# EAGLE design PassVault (EAGLE 9.6.2)
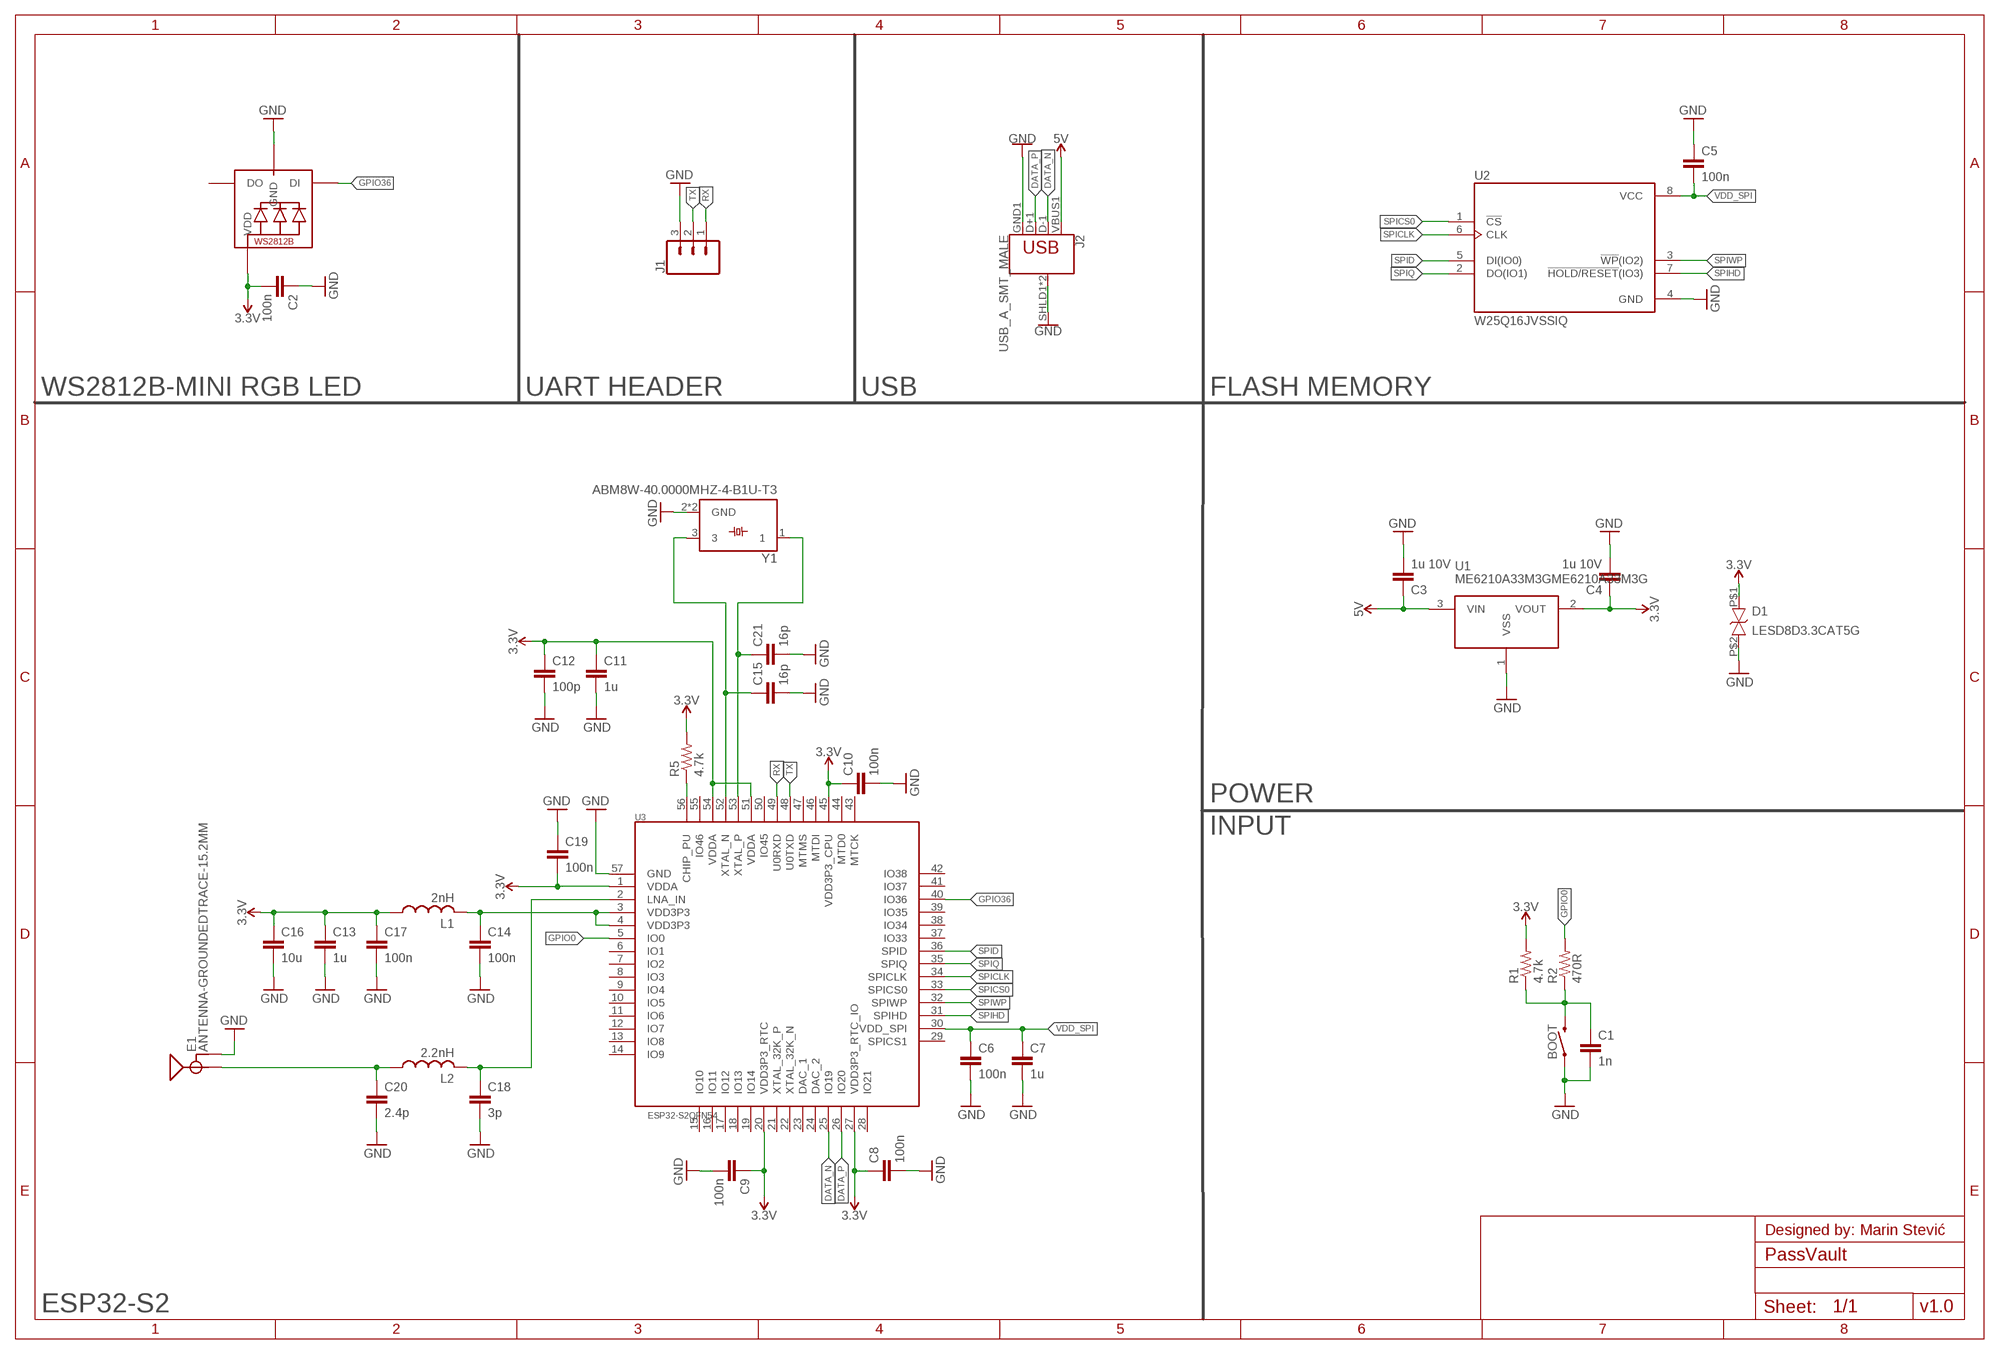
[diagram p0: schematic, sheet 1]

## Parts
BOOT  MOMENTARY-SWITCH-SPST-SMD-12MM  [TACTILE_SWITCH_SMD_12MM]
C1  1n  C-EUC0201  [C0201]
C2  100n  C-EUC0402  [C0402]
C3  1u 10V  C-EUC0402  [C0402]
C4  1u 10V  C-EUC0402  [C0402]
C5  100n  C-EUC0201  [C0201]
C6  100n  C-EUC0201  [C0201]
C7  1u  C-EUC0201  [C0201]
C8  100n  C-EUC0201  [C0201]
C9  100n  C-EUC0201  [C0201]
C10  100n  C-EUC0201  [C0201]
C11  1u  C-EUC0201  [C0201]
C12  100p  C-EUC0201  [C0201]
C13  1u  C-EUC0201  [C0201]
C14  100n  C-EUC0201  [C0201]
C15  16p  C-EUC0201  [C0201]
C16  10u  C-EUC0402  [C0402]
C17  100n  C-EUC0201  [C0201]
C18  3p  C-EUC0201  [C0201]
C19  100n  C-EUC0201  [C0201]
C20  2.4p  C-EUC0201  [C0201]
C21  16p  C-EUC0201  [C0201]
D1  LESD8D3.3CAT5G  [LESD8D3.3CAT5G]
E1  ANTENNA-GROUNDEDTRACE-15.2MM  [TRACE_ANTENNA_2.4GHZ_15.2MM]
J1  CONN_03  [1X03]
J2  USB_A_SMT_MALE  [USB-A-SMT-MALE]
L1  2nH  L-USL0201  [L0201]
L2  2.2nH  L-USL0201  [L0201]
LED1  WS2812B3535  [LED3535]
R1  4.7k  R-US_R0201  [R0201]
R2  470R  R-US_R0201  [R0201]
R5  4.7k  R-US_R0201  [R0201]
U1  ME6210A33M3GME6210A33M3G  [SOT95P280X110-3N]
U2  W25Q16JVSSIQ  [SOIC127P790X216-8N]
U3  ESP32-S2QFN54  [QFN40P700X700X90-57T400N]
Y1  ABM8W-40.0000MHZ-4-B1U-T3  [OSCSC320X250X100N]

## Nets
3.3V: C2.2 C4.1 C8.1 C9.1 C10.1 C11.1 C12.1 C13.1 C16.1 C17.1 C19.2 D1.P$1 L1.1 LED1.1(VDD) R1.2 R5.2 U1.2(VOUT) U3.1(VDDA) U3.20(VDD3P3_RTC) U3.27(VDD3P3_RTC_IO) U3.45(VDD3P3_CPU) U3.51(VDDA) U3.54(VDDA)
3.3V1: C20.1 E1.ANT(SIGNAL) L2.1
5V: C3.1 J2.VBUS1(VBUS) U1.3(VIN)
DATA_N: J2.D-1(D-) U3.25(IO19)
DATA_P: J2.D+1(D+) U3.26(IO20)
GND: BOOT.1 C1.2 C2.1 C3.2 C4.2 C5.1 C6.2 C7.2 C8.2 C9.2 C10.2 C11.2 C12.2 C13.2 C14.2 C15.2 C16.2 C17.2 C18.2 C19.1 C20.2 C21.2 D1.P$2 E1.GND J1.3 J2.GND1(GND) J2.SHLD1(SHIELD) J2.SHLD2(SHIELD) LED1.3(GND) U1.1(VSS) U2.4(GND) U3.57(GND) Y1.2(GND) Y1.4(GND)
GPIO0: R2.2 U3.5(IO0)
GPIO36: LED1.4(DI) U3.40(IO36)
N$1: R5.1 U3.56(CHIP_PU)
N$3: BOOT.3 C1.1 R1.1 R2.1
N$7: C14.1 L1.2 U3.3(VDD3P3) U3.4(VDD3P3)
N$8: C15.1 U3.52(XTAL_N) Y1.3
N$9: C21.1 U3.53(XTAL_P) Y1.1
N$10: C18.1 L2.2 U3.2(LNA_IN)
RX: J1.1 U3.49(U0RXD)
SPICLK: U2.6(CLK) U3.34(SPICLK)
SPICS0: U2.1(!CS) U3.33(SPICS0)
SPID: U2.5(DI(IO0)) U3.36(SPID)
SPIHD: U2.7(!HOLD/RESET!(IO3)) U3.31(SPIHD)
SPIQ: U2.2(DO(IO1)) U3.35(SPIQ)
SPIWP: U2.3(!WP!(IO2)) U3.32(SPIWP)
TX: J1.2 U3.48(U0TXD)
VDD_SPI: C5.2 C6.1 C7.1 U2.8(VCC) U3.30(VDD_SPI)
Unconnected: LED1.2(DO) U3.6(IO1) U3.7(IO2) U3.8(IO3) U3.9(IO4) U3.10(IO5) U3.11(IO6) U3.12(IO7) U3.13(IO8) U3.14(IO9) U3.15(IO10) U3.16(IO11) U3.17(IO12) U3.18(IO13) U3.19(IO14) U3.21(XTAL_32K_P) U3.22(XTAL_32K_N) U3.23(DAC_1) U3.24(DAC_2) U3.28(IO21) U3.29(SPICS1) U3.37(IO33) U3.38(IO34) U3.39(IO35) U3.41(IO37) U3.42(IO38) U3.43(MTCK) U3.44(MTD0) U3.46(MTDI) U3.47(MTMS) U3.50(IO45) U3.55(IO46)

## Notes on the sheet
- WS2812B-MINI RGB LED | UART HEADER | USB | FLASH MEMORY
- POWER
- INPUT
- Designed by: Marin Stević
- ESP32-S2 | v1.0

## Library data of the parts
BOOT = SparkFun-Switches:MOMENTARY-SWITCH-SPST: Momentary Switch (Pushbutton) - SPST Normally-open (NO) SPST momentary switches (buttons, pushbuttons). Variants PTH-12MM - 12mm square, through-hole Momentary Pushbutton Switch - 12mm Square <https://www.sparkfun.com/products/9190> (COM-09190) PTH-6.0MM, PTH-6.0MM-KIT - 6.0mm square, through-hole Mini Pushbutton Switch <https://www.sparkfun.com/products/97> (COM-00097) KIT package intended for soldering kit's - only one side of pads' copper is exposed. PTH-RIGHT-ANGLE-KIT - Right-angle, through-hole Right Angle Tactile Button <https://www.sparkfun.com/products/10791> - Used on SparkFun BigTime Watch Kit <https://www.sparkfun.com/products/11734> SMD-12MM - 12mm square, surface-mount Tactile Button - SMD (12mm) <https://www.sparkfun.com/products/12993> (COM-12993) Used on SparkFun PicoBoard <https://www.sparkfun.com/products/11888> SMD-4.5MM - 4.5mm Square Trackball Switch Used on SparkFun Blackberry Trackballer Breakout <https://www.sparkfun.com/products/13169> SMD-4.6MMX2.8MM - 4.60mm x 2.80mm, surface mount Used on SparkFun SAMD21 Mini Breakout <https://www.sparkfun.com/products/13664> SMD-5.2MM, SMD-5.2-REDUNDANT - 5.2mm square, surface-mount Mini Pushbutton Switch - SMD <https://www.sparkfun.com/products/8720> (COM-08720) Used on Arduino Pro Mini <https://www.sparkfun.com/products/11114> REDUNDANT package connects both switch circuits together SMD-6.0X3.5MM - 6.0 x 3.5mm, surface mount Momentary Reset Switch SMD <https://www.sparkfun.com/products/8229> (COM-08229) SMD-6.2MM-TALL - 6.2mm square, surface mount Tactile Button - SMD (6mm) <https://www.sparkfun.com/products/12992> Used on SparkFun Digital Sandbox <https://www.sparkfun.com/products/12651> SMD-RIGHT-ANGLE - Right-angle, surface mount Used on SparkFun Block for Intel® Edison - Arduino <https://www.sparkfun.com/products/13036>; PROD_ID: SWCH-11967; SF_SKU: COM-12993
C1-C21 = rcl:C-EU: CAPACITOR, European symbol; SPICEPREFIX: C
D1 = Custom:LESD8D3.3CAT5G
E1 = SparkFun-RF:ANTENNA-GROUNDED: Antenna w/ Ground Connection 2.4GHz antennae with signal and ground terminals. TRACE_ANTENNA_2.4GHZ_15.2MM - Meander Trace antenna 15.2 x 5.7mm footprint Based on layout from TI app note AN043 <http://www.ti.com/lit/an/swra117d/swra117d.pdf>. TRACE_ANTENNA_2.4GHZ_25.7MM - Inverted F trace antenna 25.7 x 7.5 mm footprint. Based on layout from TI design note DN0007 <http://www.ti.com/lit/an/swru120b/swru120b.pdf>.
J1 = SparkFun-Connectors:CONN_03: Multi connection point. Often used as Generic Header-pin footprint for 0.1 inch spaced/style header connections On any of the 0.1 inch spaced packages, you can populate with these: Break Away Headers - Straight <https://www.sparkfun.com/products/116> (PRT-00116) Break Away Male Headers - Right Angle <https://www.sparkfun.com/products/553> (PRT-00553) Female Headers <https://www.sparkfun.com/products/115> (PRT-00115) Break Away Headers - Machine Pin <https://www.sparkfun.com/products/117> (PRT-00117) Break Away Female Headers - Swiss Machine Pin <https://www.sparkfun.com/products/743> (PRT-00743) Stackable Header - 3 Pin (Female, 0.1") <https://www.sparkfun.com/products/13875> (PRT-13875) For SCREWTERMINALS and SPRING TERMINALS visit here: Screw Terimnals on SparkFun.com <https://www.sparkfun.com/search/results?term=Screw+Terminals> (5mm/3.5mm/2.54mm spacing) This device is also useful as a general connection point to wire up your design to another part of your project. Our various solder wires solder well into these plated through hole pads. Hook-Up Wire - Assortment (Stranded, 22 AWG) <https://www.sparkfun.com/products/11375> (PRT-11375) Hook-Up Wire - Assortment (Solid Core, 22 AWG) <https://www.sparkfun.com/products/11367> (PRT-11367) View the entire wire category on our website here <https://www.sparkfun.com/categories/141> Special notes: Molex polarized connector foot print use with SKU : PRT-08232 with associated crimp pins and housings.
J2 = SparkFun-Connectors:USB_A: USB-A Connector Male and female variants, as well as PTH and SMT variants SparkFun Products: SparkFun XBee Explorer Dongle <https://www.sparkfun.com/products/11697> PTH Male SparkFun MicroView-USB Programmer <https://www.sparkfun.com/products/12924> SMT Male SparkFun USB Type A Female Breakout <https://www.sparkfun.com/products/12700> SMT Female; PROD_ID: CONN-11499
L1 L2 = rcl:L-US: INDUCTOR, American symbol; SPICEPREFIX: L
LED1 = Custom:WS2812B; AVAILABILITY: Unavailable; DESCRIPTION: Raspberry Pi HAT _40 pin_ Wheeled Robotics Kit; MF: SparkFun Electronics; MP: WS2812B; PACKAGE: None; PRICE: None
R1 R2 R5 = rcl:R-US_: RESISTOR, American symbol; SPICEPREFIX: R
U1 = Custom:ME6210A33M3G
U2 = Custom:W25Q16JVSSIQ: 3v 16m-Bit Serial Flash Memory With Dual; AVAILABILITY: Unavailable; DESCRIPTION: FLASH - NOR Memory IC 16Mb (2M x 8) SPI - Quad I/O 133MHz 8-SOIC; MF: Winbond Electronics; MP: W25Q16JVSSIQ; PACKAGE: SOIC-8 Winbond; PRICE: None
U3 = ESP32-S2:ESP32-S2: Check prices <https://pricing.snapeda.com/parts/ESP32-S2/Espressif%20Systems/view-part?ref=eda>; AVAILABILITY: In Stock; DESCRIPTION: WiFi 802.11b/g/n Transceiver Module 2.4GHz Antenna Not Included Surface Mount; MF: Espressif Systems; MP: ESP32-S2; PACKAGE: None; PRICE: None
Y1 = ABM8W-40.0000MHZ-4-B1U-T3:ABM8W-40.0000MHZ-4-B1U-T3: Crystal 20MHz Â±20ppm (Tol) Â±30ppm (Stability) 18pF FUND 80Ohm 4-Pin Mini-CSMD T/R Check prices <https://pricing.snapeda.com/parts/ABM8W-40.0000MHZ-4-B1U-T3/Abracon/view-part?ref=eda>; AVAILABILITY: In Stock; DESCRIPTION: 40MHz ±10ppm Crystal 4pF 30 Ohms 4-SMD, No Lead; MF: Abracon; MP: ABM8W-40.0000MHZ-4-B1U-T3; PACKAGE: SMD-4 Abracon; PRICE: None; PURCHASE-URL: https://pricing.snapeda.com/search/part/ABM8W-40.0000MHZ-4-B1U-T3/?ref=eda

## Board
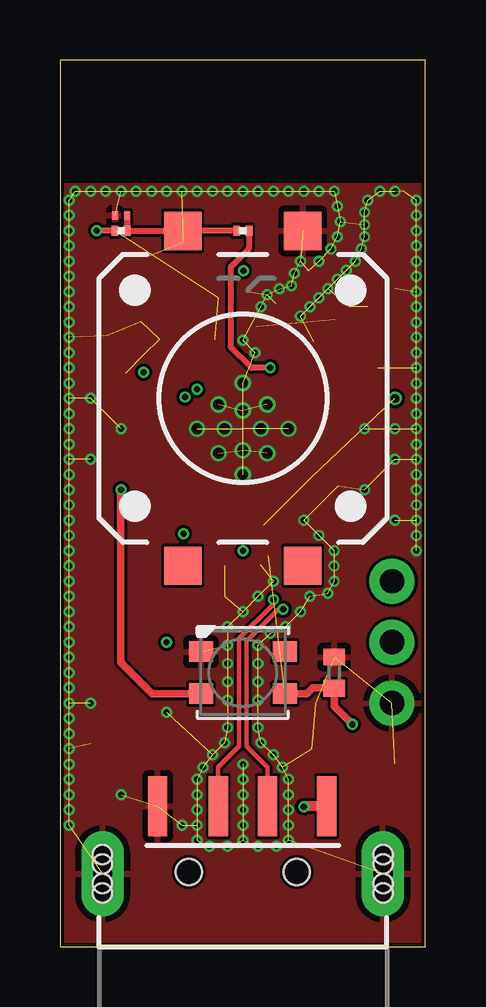
[diagram p1: board, top side]
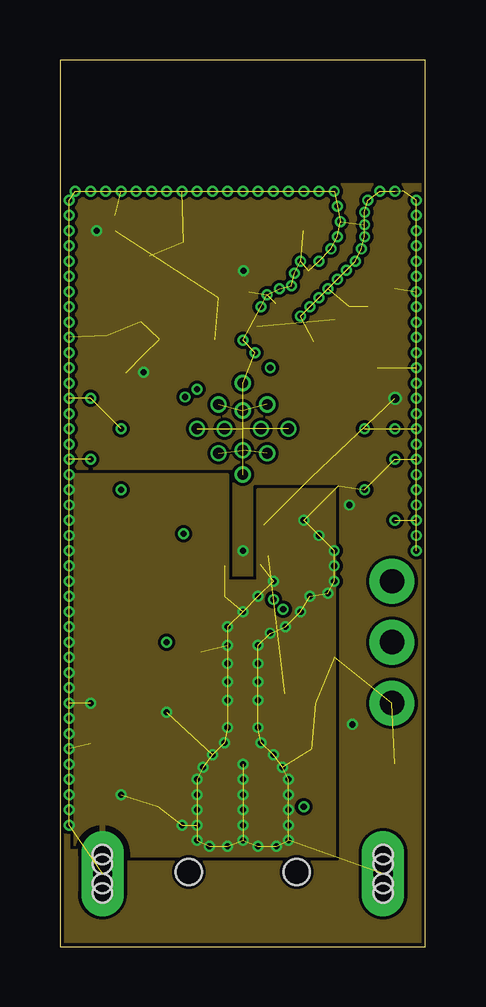
[diagram p2: board, inner layer Route2]
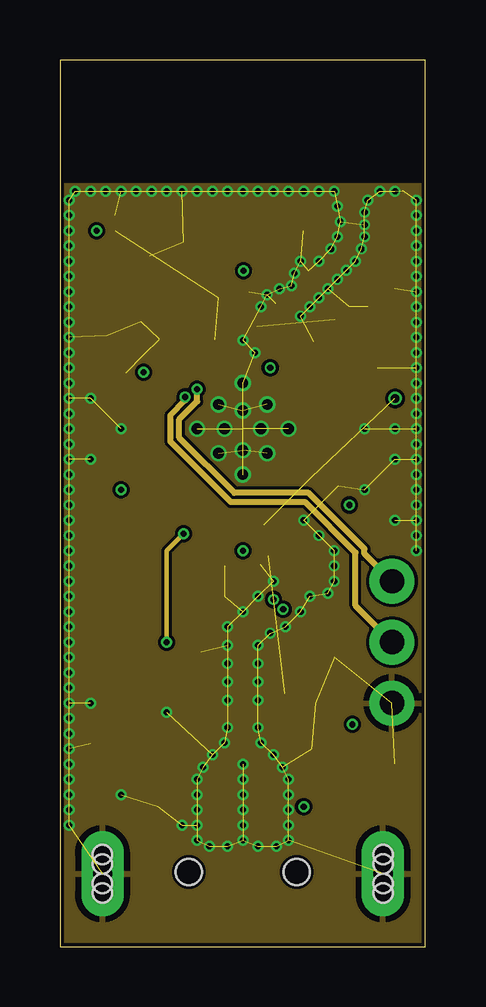
[diagram p3: board, inner layer Route15]
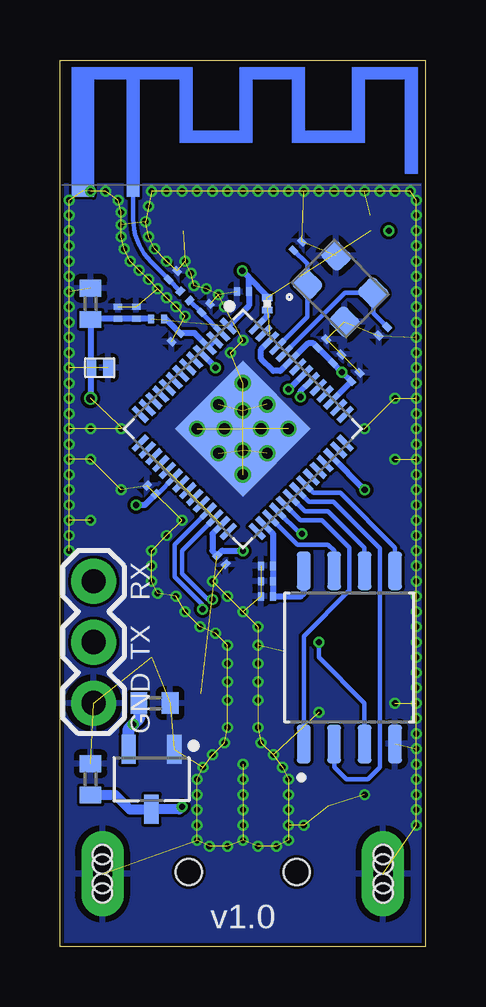
[diagram p4: board, bottom side, seen from below]

Size 15.24 x 36.96 mm. Coordinates in mm from the lower left corner, seen from the top.
Outline: 0,0 15.24,0 15.24,36.96 0,36.96 0,0
Copper layers (1+2*15+16): Top 0.035mm / dielectric 0.11mm / Route2 0.035mm / dielectric 1.13mm / Route15 0.035mm / dielectric 0.11mm / Bottom 0.035mm
Design rules "pcbway4layer_newest": minimum track width 5mil, minimum drill 10mil, track to track 5mil, track to pad 5mil, pad to pad 5mil, via to via 5mil, smd to smd 5mil, copper to edge 6mil, drill to drill 6mil, minimum pad ring 4mil, minimum via ring 4mil, stop-mask expansion 1.5mil, vias tented up to drill 28mil, thermal gap 10mil

### Footprints (pad centres in the part's own frame; a part is rotated, then mirrored left to right if it is on the bottom)
TACTILE_SWITCH_SMD_12MM = smd 1.6 x 1.55: 1 6.975,-2.5; 2 -6.975,-2.5; 3 6.975,2.5; 4 -6.975,2.5
C0201 = smd 0.25 x 0.35: 1 -0.25,0; 2 0.25,0
C0402 = smd 0.7 x 0.9: 1 -0.65,0; 2 0.65,0
LESD8D3.3CAT5G = smd 0.4 x 0.7: P$1 -0.35,0; P$2 0.35,0
TRACE_ANTENNA_2.4GHZ_15.2MM = smd 0.5 x 0.5: ANT 0,-0.25 | smd 0.9 x 0.5: GND -2.1,-0.25
1X03 = drill 1.016 pad 1.88: 1 0,0; 2 2.54,0; 3 5.08,0
USB-A-SMT-MALE = smd 2.5 x 0.8: D+1 10.95,1.027; D-1 10.95,-1.027; GND1 10.95,3.551; VBUS1 10.95,-3.5 | drill 0.8 pad 1.778 long: SHLD1 8.13,-5.85; SHLD2 8.13,5.85 | hole 1.1: 8.2,2.25; 8.2,-2.25 | hole 0.8: 8.53,-5.85; 8.93,-5.85; 7.73,-5.85; 7.33,-5.85; 8.53,5.85; 8.93,5.85; 7.73,5.85; 7.33,5.85
L0201 = smd 0.25 x 0.35: 1 -0.275,0; 2 0.275,0
LED3535 = smd 1 x 0.85: 1 -1.75,0.875; 2 -1.75,-0.875; 3 1.75,-0.875; 4 1.75,0.875
R0201 = smd 0.28 x 0.43: 1 -0.255,0; 2 0.255,0
SOT95P280X110-3N = smd 1.215 x 0.597: 1 -1.25,0.95; 2 -1.25,-0.95; 3 1.25,0
SOIC127P790X216-8N = smd 1.61 x 0.58: 1 -3.605,1.905; 2 -3.605,0.635; 3 -3.605,-0.635; 4 -3.605,-1.905; 5 3.605,-1.905; 6 3.605,-0.635; 7 3.605,0.635; 8 3.605,1.905
QFN40P700X700X90-57T400N = smd 0.81 x 0.22: 1 -3.445,2.6; 2 -3.445,2.2; 3 -3.445,1.8; 4 -3.445,1.4; 5 -3.445,1; 6 -3.445,0.6; 7 -3.445,0.2; 8 -3.445,-0.2; 9 -3.445,-0.6; 10 -3.445,-1; 11 -3.445,-1.4; 12 -3.445,-1.8; 13 -3.445,-2.2; 14 -3.445,-2.6; 29 3.445,-2.6; 30 3.445,-2.2; 31 3.445,-1.8; 32 3.445,-1.4; 33 3.445,-1; 34 3.445,-0.6; 35 3.445,-0.2; 36 3.445,0.2; 37 3.445,0.6; 38 3.445,1; 39 3.445,1.4; 40 3.445,1.8; 41 3.445,2.2; 42 3.445,2.6 | smd 0.22 x 0.81: 15 -2.6,-3.445; 16 -2.2,-3.445; 17 -1.8,-3.445; 18 -1.4,-3.445; 19 -1,-3.445; 20 -0.6,-3.445; 21 -0.2,-3.445; 22 0.2,-3.445; 23 0.6,-3.445; 24 1,-3.445; 25 1.4,-3.445; 26 1.8,-3.445; 27 2.2,-3.445; 28 2.6,-3.445; 43 2.6,3.445; 44 2.2,3.445; 45 1.8,3.445; 46 1.4,3.445; 47 1,3.445; 48 0.6,3.445; 49 0.2,3.445; 50 -0.2,3.445; 51 -0.6,3.445; 52 -1,3.445; 53 -1.4,3.445; 54 -1.8,3.445; 55 -2.2,3.445; 56 -2.6,3.445 | smd 4 x 4: 57 0,0
OSCSC320X250X100N = smd 0.98 x 1.1: 1 -0.85,1.1; 2 -0.85,-1.1; 3 0.85,-1.1; 4 0.85,1.1

### Placement (x,y rotation side)
BOOT  7.62,22.86 90 top
C1  2.54,30.48 180 top
C2  11.43,11.43 270 top
C3  13.97,6.99 90 bottom
C4  11.3,10.16 0 bottom
C5  6.6,14.61 0 bottom
C6  6.6,15.24 180 bottom
C7  6.6,15.88 180 bottom
C8  8.51,16.13 315 bottom
C9  11.43,19.05 135 bottom
C10  2.92,23.75 45 bottom
C11  3.68,24.51 45 bottom
C12  4.32,25.15 45 bottom
C13  12.83,26.42 90 bottom
C14  10.41,25.4 225 bottom
C15  1.78,25.65 225 bottom
C16  13.97,26.8 90 bottom
C17  12.06,26.42 90 bottom
C18  9.17,26.62 45 bottom
C19  7.62,27.3 0 bottom
C20  10.54,27.99 45 bottom
C21  5.33,29.21 45 bottom
D1  13.59,24.13 0 bottom
E1  12.19,31.75 0 bottom
J1  13.84,15.24 270 bottom
J2  7.62,-5.08 90 top
L1  11.18,26.16 0 bottom
L2  10.03,27.13 315 bottom
LED1  7.62,11.43 180 top
R1  2.54,29.84 180 top
R2  7.62,29.84 0 top
R5  6.6,26.8 90 bottom
U1  11.43,6.99 270 bottom
U2  3.17,12.06 90 bottom
U3  7.62,21.59 315 bottom
Y1  3.56,27.43 45 bottom

### Tracks (layer width: path | path; a pad name or v marks a point on that pad's centre or on a via)
3.3V  (via drill 0.25, 0.35)  (6 unrouted)
  Top 0.254: R1.2 v1.52,29.84
  Top 0.305: LED1.1 10.3,10.55 10.54,10.79 11.41,10.79 C2.2 11.43,10.03 v12.19,9.27
  Bottom 0.186: U3.20 11.19,18.87 C9.1
  Bottom 0.254: U3.45 C10.1 v3.48,23.95 C11.1 C12.1 4.67,25.15 4.91,25.15 U3.51 6.06,24 6.35,24 6.86,24.51 6.86,24.9 U3.54 | C9.1 11.71,18.41 v12.06,18.41 | U3.27 8.89,17.21 8.89,16.51 C8.1 8.48,16.51 v7.62,16.51 | U3.1 7.36,26.72 C19.2 7.37,27.9 | 7.37,27.9 v7.64,28.17 | 7.37,27.9 6.6,27.13 R5.2 | L1.1 C17.1 C13.1 13.95,26.17 | 13.95,26.17 C16.1 | v13.97,22.86 13.94,22.89 D1.P$1 13.95,24.14 13.95,26.17
  Bottom 0.508: U1.2 12.38,9.08 v12.19,9.27 11.95,9.51 C4.1
  pour Route2 (rank 2): -1.27,-1.27 16.51,-1.27 16.51,31.75 -1.27,31.75
3.3V1
  Bottom 0.186: L2.1 C20.1 11.45,28.54 arc45 12.19,30.34 E1.ANT
5V  (via drill 0.25)
  Top 0.406: J2.VBUS1 10.19,5.87 v10.16,5.84
  Bottom 0.406: C3.1 12.94,6.33 12.34,5.74 U1.3 10.27,5.74 v10.16,5.84
DATA_N  (via drill 0.25)
  Top 0.186: J2.D-1 8.65,7.49 7.78,8.36 7.78,12.73 9.11,14.06 v9.3,14.06
  Bottom 0.186: v9.3,14.06 9.3,14.26 10.47,15.43 10.47,16.76 U3.25 | U3.25
DATA_P  (via drill 0.25)
  Top 0.186: J2.D+1 6.59,7.49 7.46,8.36 7.46,12.86 8.89,14.29 v8.89,14.48
  Bottom 0.186: v8.89,14.48 9.08,14.48 10.16,15.56 10.16,16.51 10.15,16.51 U3.26
GND  (via drill 0.25, 0.45)  (218 unrouted)
  other vias: 10.03,26.29 10.41,26.67 10.79,27.05 11.18,27.43 11.56,27.81 11.94,28.19 12.32,28.57 12.57,29.08 12.7,29.59 12.7,30.1 12.7,30.61 12.83,31.11 11.56,30.86 11.68,30.23 11.56,29.59 11.3,29.08 9.65,27.56 9.14,27.43 8.64,27.18 8.38,26.67 7.62,25.27 8.13,24.77 7.62,23.5 5.71,21.59 7.62,19.68 9.53,21.59 8.64,22.61 6.6,20.57 6.6,22.61 8.64,20.57 7.62,22.35 6.86,21.59 7.62,20.7 8.38,21.59 13.97,21.59 12.7,21.59 13.97,20.32 0.64,31.5 1.27,31.5 1.91,31.5 2.54,31.5 3.17,31.5 3.81,31.5 4.45,31.5 5.08,31.5 5.71,31.5 6.35,31.5 6.99,31.5 7.62,31.5 8.26,31.5 8.89,31.5 9.53,31.5 10.16,31.5 10.79,31.5 11.43,31.5 13.34,31.5 14.86,30.48 14.86,29.84 14.86,29.21 14.86,28.57 14.86,27.94 14.86,27.3 0.38,31.11 0.38,30.48 0.38,29.84 0.38,29.21 0.38,28.57 0.38,27.94 0.38,27.3 0.38,26.67 0.38,26.04 0.38,25.4 0.38,24.77 0.38,24.13 0.38,23.5 0.38,22.86 0.38,22.23 0.38,21.59 0.38,20.95 0.38,20.32 0.38,19.68 0.38,19.05 0.38,18.41 0.38,17.78 0.38,17.14 0.38,16.51 14.86,26.67 14.86,26.04 14.86,22.86 14.86,22.23 14.86,21.59 14.86,20.32 14.86,19.05 14.86,17.78 14.86,17.14 14.86,16.51 14.86,18.41 14.86,19.68 14.86,20.95 0.38,15.88 0.38,15.24 0.38,14.61 0.38,13.97 0.38,12.7 0.38,11.43 0.38,10.16 0.38,8.89 0.38,7.62 0.38,6.35 0.38,5.08 0.38,5.71 0.38,6.99 0.38,8.26 0.38,9.53 0.38,12.06 0.38,10.79 0.38,13.34 10.79,28.57 10.03,28.57 9.78,28.07 10.16,17.78 10.79,17.14 10.41,14.61 8.76,13.08 8.26,12.57 8.26,11.81 8.26,11.05 6.99,11.05 6.99,11.81 6.99,12.57 6.99,13.34 7.62,13.97 8.26,14.61 8.89,15.24 6.35,8 6.86,8.51 8.38,8.51 8.89,8 7.62,7.62 5.08,5.08 2.54,6.35 1.27,20.32 1.27,22.86 2.54,21.59 12.7,19.05 13.97,17.78 8.26,9.14 6.99,9.14 8.26,10.29 6.99,10.29 9.4,13.34 10.03,13.97 9.27,7.49 5.97,7.49 7.62,6.99 7.62,6.35 7.62,5.71 7.62,5.08 7.62,4.45 8.26,4.19 9.02,4.19 9.53,4.45 9.53,5.71 9.53,6.35 9.53,6.99 5.71,6.35 5.71,5.71 5.71,5.08 5.71,6.99 6.99,4.19 6.22,4.19 5.71,4.45 9.53,5.08 11.43,16.51 11.43,15.88 11.43,15.24 11.18,14.73 4.45,9.78 1.27,10.16 14.86,25.4 14.86,24.77 14.86,23.5 14.86,24.13 13.97,31.5 14.86,31.11
  pour Top (rank 2): -1.27,-1.27 16.51,-1.27 16.51,31.75 -1.27,31.75
  pour Bottom (rank 2): -1.27,31.75 -1.27,-1.27 16.51,-1.27 16.51,31.75
  pour Route15 (rank 2): -1.27,-1.27 16.51,-1.27 16.51,31.75 -1.27,31.75
  pour Route2: 0.64,3.81 0.64,19.68 6.99,19.68 6.99,15.24 8.26,15.24 8.26,19.05 11.43,19.05 11.43,3.81
  pour Bottom (no thermals): 9.91,9.14 9.91,7.37 11.05,7.37 11.05,9.14
GPIO0  (via drill 0.25)
  Top 0.254: R2.2 7.88,29.08 7.11,28.32 7.11,25.02 8,24.13 v8.76,24.13
  Bottom 0.254: v8.76,24.13 8.76,24.15 U3.5
GPIO36  (via drill 0.25)
  Top 0.305: v2.54,19.05 2.52,19.04 2.52,11.87 3.83,10.55 LED1.4
  Bottom 0.254: v2.54,19.05 v2.54,19.06 U3.40
N$1
  Bottom 0.254: U3.56 6.6,26.28 R5.1
N$3
  Top 0.254: R2.1 BOOT.3 | BOOT.3 | C1.1 R1.1 BOOT.3
N$7
  Bottom 0.254: U3.3 U3.4 9.63,25.58 C14.1 10.82,26.16 L1.2
N$8
  Bottom 0.186: C15.1 2.18,26.41 Y1.3 3.37,27.25 U3.52
N$9
  Bottom 0.186: C21.1 4.93,28.46 Y1.1 4.93,26.25 U3.53
N$10
  Bottom 0.186: U3.2 9.35,26.43 C18.1 L2.2
RX  (via drill 0.25)
  Route15 0.254: J1.1 12.7,16.38 12.7,16.59 10.37,18.92 7.27,18.92 4.97,21.22 4.97,21.99 5.71,22.73 v5.71,23.24
  Bottom 0.254: v5.71,23.24 5.69,23.24 U3.49
SPICLK
  Bottom 0.186: U3.34 5.04,18.16 4.06,18.16 2.54,16.64 U2.6
SPICS0
  Bottom 0.186: U3.33 5.22,17.78 4.32,17.78 3.17,16.64 3.17,14.86 5.08,12.95 U2.1
SPID
  Bottom 0.186: U3.36 4.67,18.92 3.56,18.92 1.27,16.64 U2.5
SPIHD
  Bottom 0.186: U3.31 5.34,16.76 4.06,16.76 3.81,16.51 U2.7
SPIQ
  Bottom 0.186: U3.35 4.86,18.54 3.84,18.54 1.91,16.61 1.91,13.97 1.91,7.49 2.41,6.99 3.3,6.99 3.81,7.49 U2.2
SPIWP  (via drill 0.25)
  Route15 0.186: v5.15,17.21 4.45,16.5 v4.45,12.7
  Bottom 0.186: U2.3 2.54,10.16 4.45,12.06 v4.45,12.7 | U3.32 5.22,17.21 v5.15,17.21
TX  (via drill 0.25)
  Route15 0.254: J1.2 12.32,14.22 12.32,16.43 10.21,18.54 7.11,18.54 4.59,21.07 4.59,22.14 5.21,22.77 v5.21,22.91
  Bottom 0.254: v5.21,22.91 5.21,23.15 U3.48
VDD_SPI
  Bottom 0.254: U3.30 6.35,17.21 C7.1 C6.1 C5.2 5.21,14.61 5.08,14.73 U2.8

### Text on the board
bPlace: RX | TX | GND | v1.0